# Altium schematic sheet 3_Port_IO板.schdoc.schdoc
size 431 x 309 mm; Symbol: Sheet-Symbol_A3; Device: Sheet-Symbol_A3; Company: 嘉立创EDA; Version: V1.0; Page Size: A3; @Project Name: 0117_230627_uMSX 4.0; @Page Count: 4; @Update Date: 2023-07-03; @Schematic Name: uMSX 4.0; @Page No: 3; @Page Name: Port/IO板
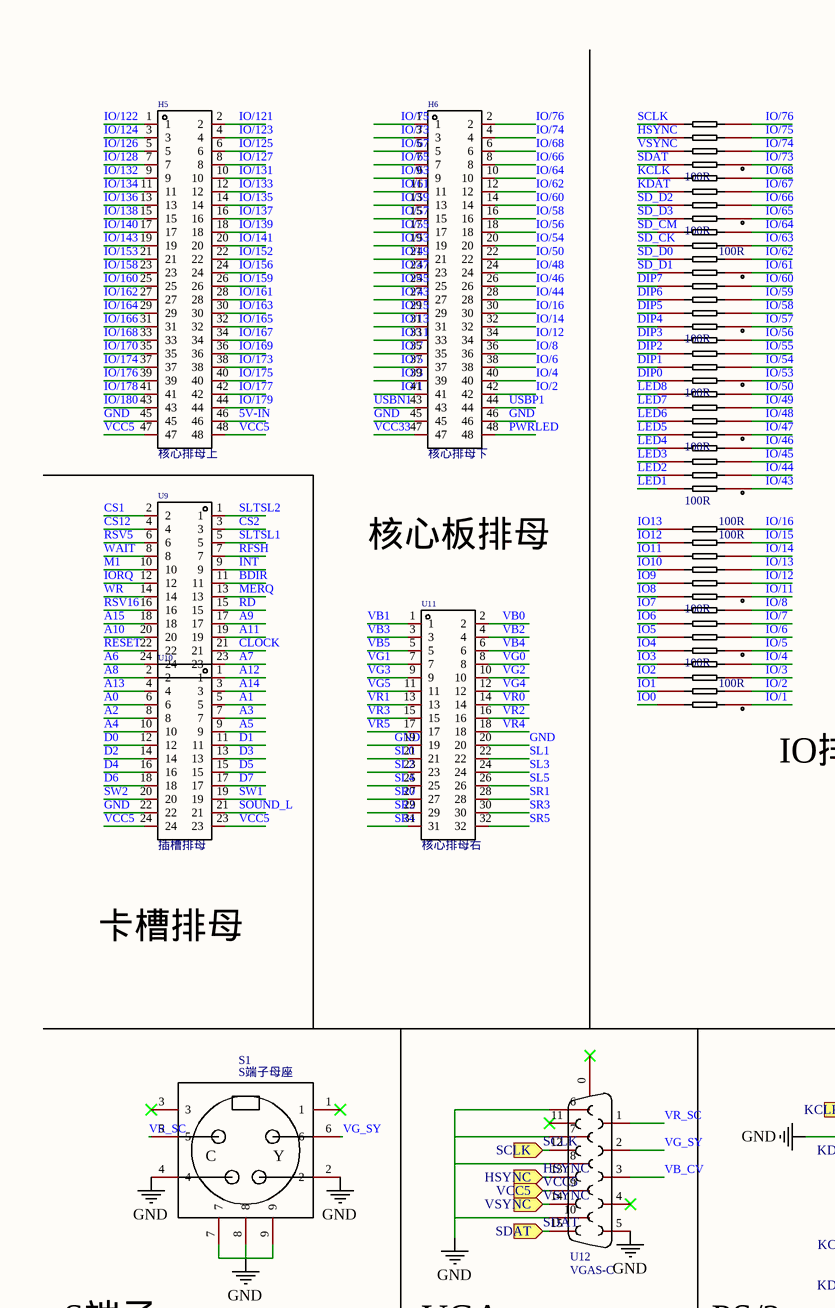
[diagram p0: 3_Port_IO板.schdoc.schdoc, top left]
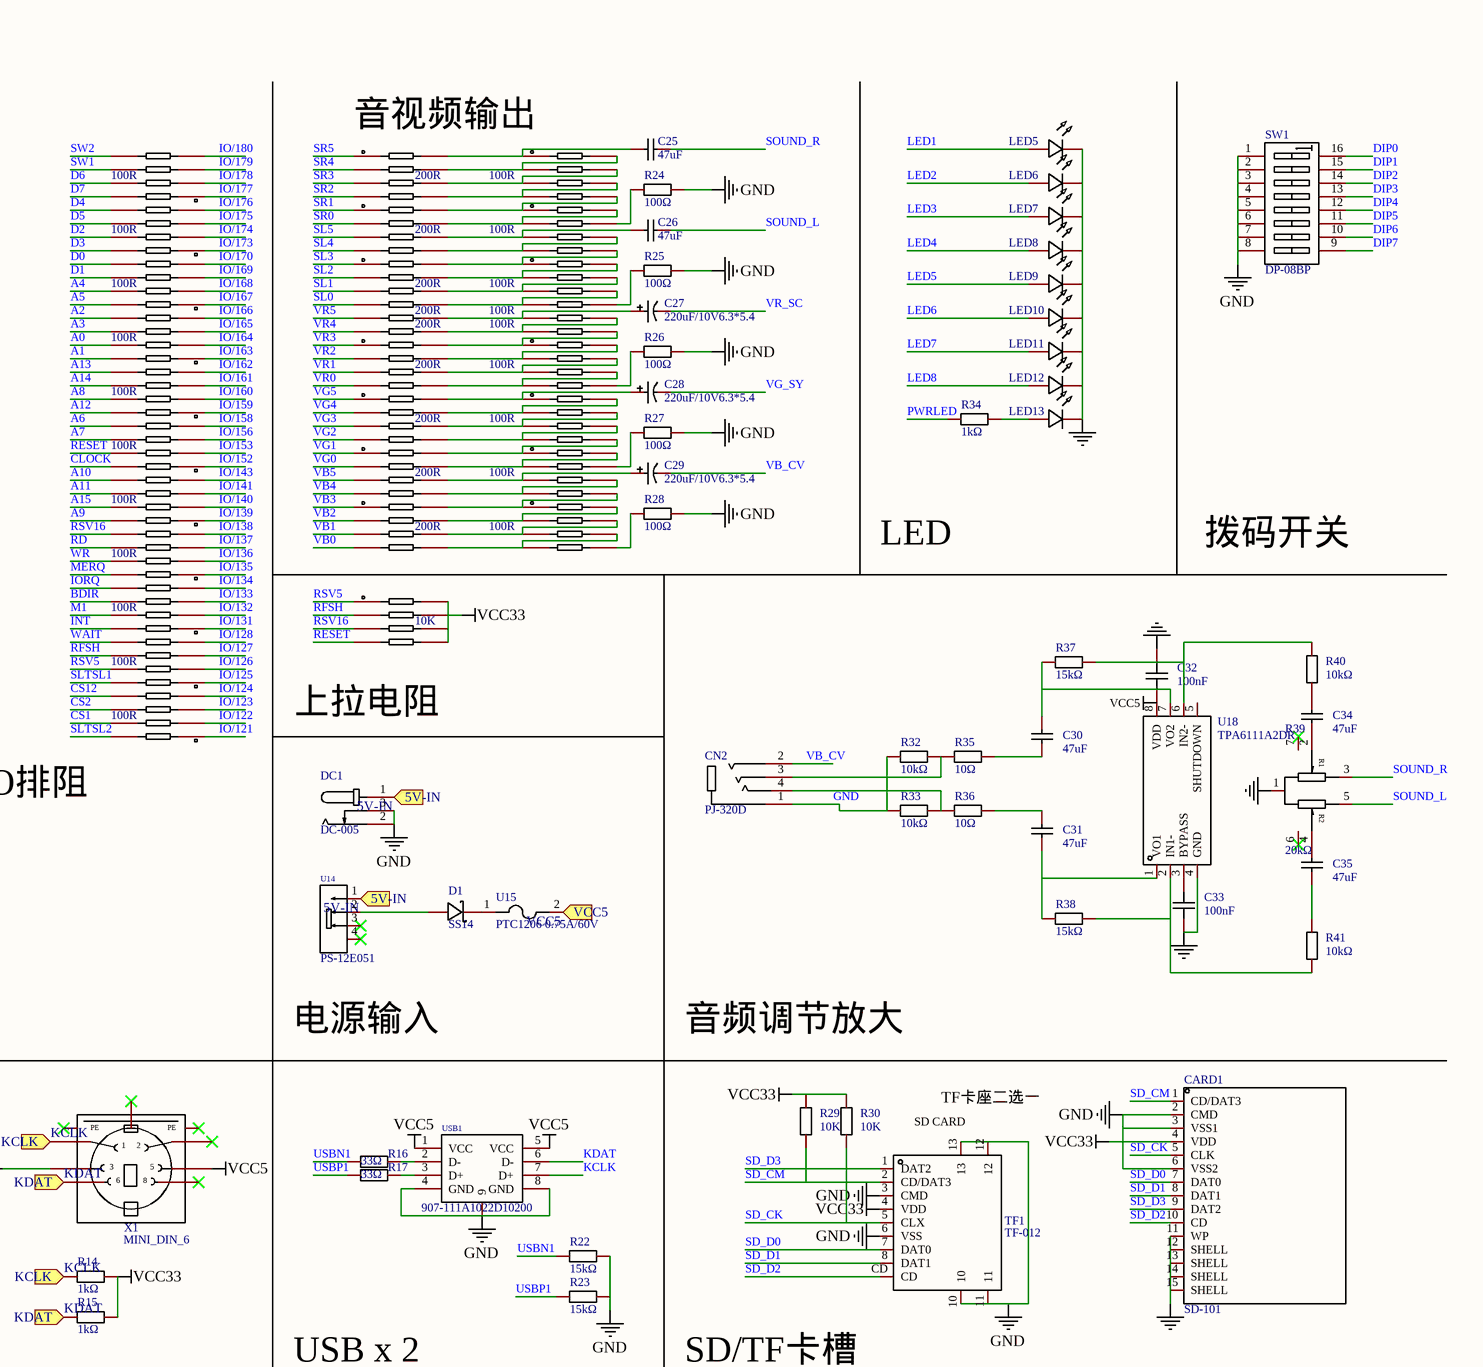
[diagram p1: 3_Port_IO板.schdoc.schdoc, top right]
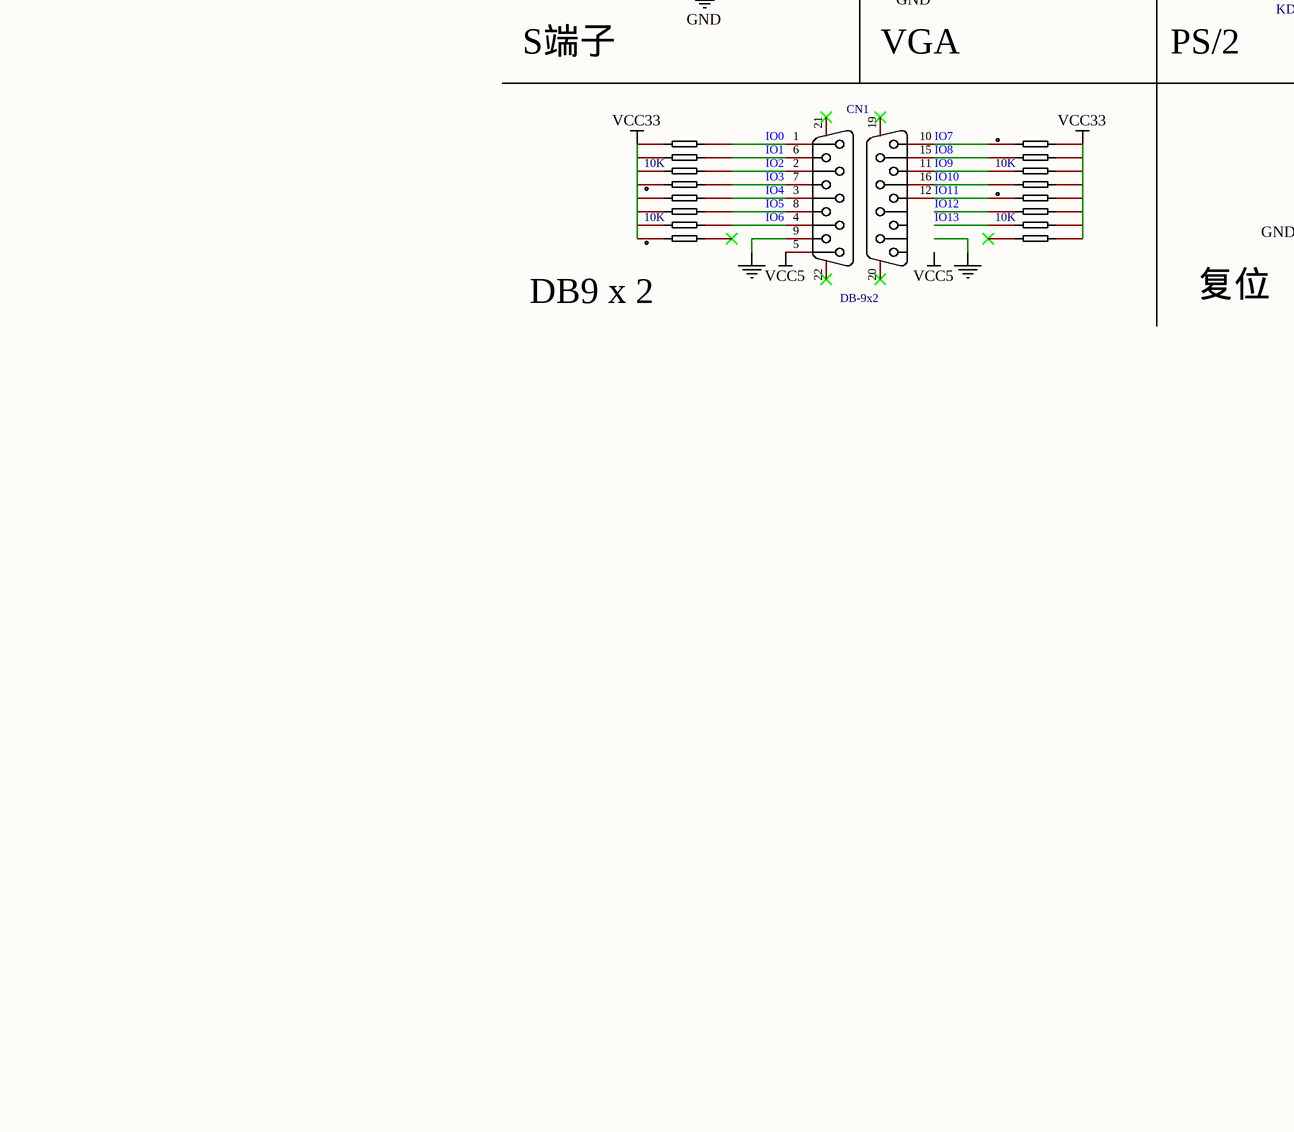
[diagram p2: 3_Port_IO板.schdoc.schdoc, bottom left]
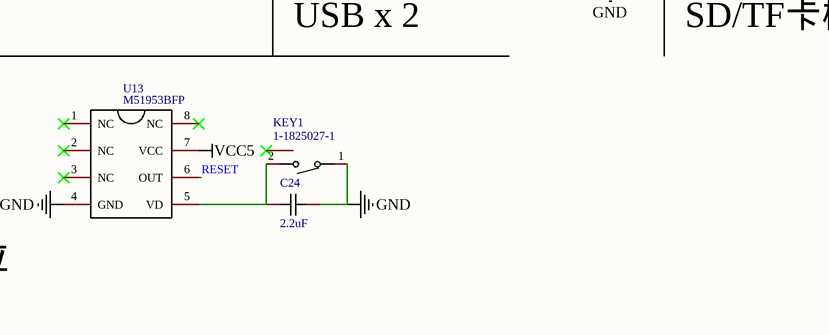
[diagram p3: 3_Port_IO板.schdoc.schdoc, bottom right]

## Parts
C24  2.2uF  [C0603]
C25  47uF  [C0805]
C26  47uF  [C0805]
C27  220uF/10V6.3*5.4  [CAP-SMD_BD6.3-L6.6-W6.6-LS7.2-FD]
C28  220uF/10V6.3*5.4  [CAP-SMD_BD6.3-L6.6-W6.6-LS7.2-FD]
C29  220uF/10V6.3*5.4  [CAP-SMD_BD6.3-L6.6-W6.6-LS7.2-FD]
C30  47uF  [C0805]
C31  47uF  [C0805]
C32  100nF  [C0603]
C33  100nF  [C0603]
C34  47uF  [C0805]
C35  47uF  [C0805]
CARD1  SD-101  [SD-SMD_SD-101]
CN1  DB-9x2  [DSUB-TH_HYC33-VGA18A-158]
CN2  PJ-320D  [AUDIO-SMD_PJ-320D]
D1  SS14  [SMA_L4.2-W2.6-LS5.3-RD]
DC1  DC-005  [DC-IN-TH_DC-005-A]
H5  核心排母上  [HDR-TH_48P-P2.54-V-F-R2-C24-S2.54]
H6  核心排母下  [HDR-TH_48P-P2.54-V-F-R2-C24-S2.54]
KEY1  1-1825027-1  [KEY-TH_1-1825027-1]
LED5  LED_0603-R  [LED_0603]  (value not drawn)
LED6  LED_0603-R  [LED_0603]  (value not drawn)
LED7  LED_0603-R  [LED_0603]  (value not drawn)
LED8  LED_0603-R  [LED_0603]  (value not drawn)
LED9  LED_0603-R  [LED_0603]  (value not drawn)
LED10  LED_0603-R  [LED_0603]  (value not drawn)
LED11  LED_0603-R  [LED_0603]  (value not drawn)
LED12  LED_0603-R  [LED_0603]  (value not drawn)
LED13  LED_0603-R  [LED_0603]  (value not drawn)
R1  100R  [R0603]
R2  100R  [R0603]
R14  1kΩ  [R0603]
R15  1kΩ  [R0603]
R16  33Ω  [R0603]
R17  33Ω  [R0603]
R18  200R  [R0603]
R19  200R  [R0603]
R20  100R  [R0603]
R21  100R  [R0603]
R22  15kΩ  [R0603]
R23  15kΩ  [R0603]
R24  100Ω  [R0603]
R25  100Ω  [R0603]
R26  100Ω  [R0603]
R27  100Ω  [R0603]
R28  100Ω  [R0603]
R29  10K  [R0603]
R30  10K  [R0603]
R32  10kΩ  [R0603]
R33  10kΩ  [R0603]
R34  1kΩ  [R0603]
R35  10Ω  [R0603]
R36  10Ω  [R0603]
R37  15kΩ  [R0603]
R38  15kΩ  [R0603]
R39  20kΩ  [RES-TH_RK10J12E002L]
R40  10kΩ  [R0603]
R41  10kΩ  [R0603]
RN1  10K  [RES-ARRAY-SMD_0603-8P-L3.2-W1.6-BL]
RN3  10K  [RES-ARRAY-SMD_0603-8P-L3.2-W1.6-BL]
RN4  10K  [RES-ARRAY-SMD_0603-8P-L3.2-W1.6-BL]
RN5  10K  [RES-ARRAY-SMD_0603-8P-L3.2-W1.6-BL]
RN6  100R  [RES-ARRAY-SMD_0603-8P-L3.2-W1.6-BL]
RN7  100R  [RES-ARRAY-SMD_0603-8P-L3.2-W1.6-BL]
RN8  100R  [RES-ARRAY-SMD_0603-8P-L3.2-W1.6-BL]
RN9  100R  [RES-ARRAY-SMD_0603-8P-L3.2-W1.6-BL]
RN10  100R  [RES-ARRAY-SMD_0603-8P-L3.2-W1.6-BL]
RN11  100R  [RES-ARRAY-SMD_0603-8P-L3.2-W1.6-BL]
RN12  100R  [RES-ARRAY-SMD_0603-8P-L3.2-W1.6-BL]
RN13  100R  [RES-ARRAY-SMD_0603-8P-L3.2-W1.6-BL]
RN14  100R  [RES-ARRAY-SMD_0603-8P-L3.2-W1.6-BL]
RN15  100R  [RES-ARRAY-SMD_0603-8P-L3.2-W1.6-BL]
RN16  100R  [RES-ARRAY-SMD_0603-8P-L3.2-W1.6-BL]
RN17  100R  [RES-ARRAY-SMD_0603-8P-L3.2-W1.6-BL]
RN18  100R  [RES-ARRAY-SMD_0603-8P-L3.2-W1.6-BL]
RN19  100R  [RES-ARRAY-SMD_0603-8P-L3.2-W1.6-BL]
RN20  100R  [RES-ARRAY-SMD_0603-8P-L3.2-W1.6-BL]
RN21  100R  [RES-ARRAY-SMD_0603-8P-L3.2-W1.6-BL]
RN22  100R  [RES-ARRAY-SMD_0603-8P-L3.2-W1.6-BL]
RN23  100R  [RES-ARRAY-SMD_0603-8P-L3.2-W1.6-BL]
RN24  100R  [RES-ARRAY-SMD_0603-8P-L3.2-W1.6-BL]
RN25  100R  [RES-ARRAY-SMD_0603-8P-L3.2-W1.6-BL]
RN26  100R  [RES-ARRAY-SMD_0603-8P-L3.2-W1.6-BL]
RN27  200R  [RES-ARRAY-SMD_0603-8P-L3.2-W1.6-BL]
RN28  200R  [RES-ARRAY-SMD_0603-8P-L3.2-W1.6-BL]
RN29  200R  [RES-ARRAY-SMD_0603-8P-L3.2-W1.6-BL]
RN30  200R  [RES-ARRAY-SMD_0603-8P-L3.2-W1.6-BL]
RN31  200R  [RES-ARRAY-SMD_0603-8P-L3.2-W1.6-BL]
RN32  200R  [RES-ARRAY-SMD_0603-8P-L3.2-W1.6-BL]
RN33  200R  [RES-ARRAY-SMD_0603-8P-L3.2-W1.6-BL]
RN34  10K  [RES-ARRAY-SMD_0603-8P-L3.2-W1.6-BL]
RN35  100R  [RES-ARRAY-SMD_0603-8P-L3.2-W1.6-BL]
RN36  100R  [RES-ARRAY-SMD_0603-8P-L3.2-W1.6-BL]
RN37  100R  [RES-ARRAY-SMD_0603-8P-L3.2-W1.6-BL]
RN38  100R  [RES-ARRAY-SMD_0603-8P-L3.2-W1.6-BL]
RN39  100R  [RES-ARRAY-SMD_0603-8P-L3.2-W1.6-BL]
RN40  100R  [RES-ARRAY-SMD_0603-8P-L3.2-W1.6-BL]
RN41  100R  [RES-ARRAY-SMD_0603-8P-L3.2-W1.6-BL]
S1  S端子母座  [S端子母座]
SW1  DP-08BP  [SW-TH_DP-08XP]
TF1  TF-012  [TF-SMD_TF-012]
U9  PM254-2-12-W-8.5  [HDR-TH_24P-P2.54-H-F-R2-C12-W8.5]  (value not drawn)
U10  插槽排母  [HDR-TH_24P-P2.54-H-F-R2-C12-W8.5]
U11  核心排母右  [HDR-TH_32P-P2.54-V-F-R2-C16-S2.54]
U12  VGAS-C  [DB15-TH_FDB1519-F0DB300U1KA]
U13  M51953BFP  [SOP-8_L4.9-W3.8-P1.27-LS6.0-BL]
U14  PS-12E051  [SW-TH_PS-12E051XX]
U15  PTC1206 0.75A/60V  [F1206]
U18  TPA6111A2DR  [SOIC-8_L5.0-W4.0-P1.27-LS6.0-BL]
USB1  907-111A1022D10200  [USB-A-TH_USB-M-51]
X1  MINI_DIN_6  [M_DIN6]

## Ports
5V-IN (in), HSYNC (in), KCLK (in), KDAT (in), SCLK (in), SDAT (in), VCC5 (in), VSYNC (in)

## Nets
GND: C24.2 CARD1.2(CMD) CARD1.3(VSS1) CARD1.6(VSS2) CN2.1 DC1.2 DC1.3 H5.45 H6.45 H6.46 KEY1.1 R22.1 R23.1 R24.2 R25.2 R26.2 R27.2 R28.2 R32.2 R33.2 S1.2 S1.4 S1.7 S1.8 S1.9 SW1.1(A1) SW1.2(A2) SW1.3(A3) SW1.4(A4) SW1.5(A5) SW1.6(A6) SW1.7(A7) SW1.8(A8) TF1.3(CMD) TF1.6(VSS) TF1.10 TF1.11 TF1.12 TF1.13 U10.22 U11.19 U11.20 U12.5 U12.6 U12.7 U12.8 U12.10 U13.4(GND) USB1.4(GND) USB1.8(GND) USB1.9 X1.3
NetC32_1: C32.1 C33.2 CARD1.11(WP) CARD1.12(SHELL) CARD1.13(SHELL) CARD1.14(SHELL) CARD1.15(SHELL) CN1.9 LED5.1(C) LED6.1(C) LED7.1(C) LED8.1(C) LED9.1(C) LED10.1(C) LED11.1(C) LED12.1(C) LED13.1(C) R39.1 U18.4(GND)
VCC5: C32.2 CN1.5 H5.47 H5.48 U10.23 U10.24 U12.9 U13.7(VCC) U15.2 U18.8(VDD) USB1.1(VCC) USB1.5(VCC) X1.5 ; port VCC5
VCC33: CARD1.4(VDD) H6.47 R14.2 R15.2 R29.2 R30.2 RN1.1 RN1.2 RN1.3 RN1.4 RN3.1 RN3.2 RN3.3 RN3.4 RN4.5 RN4.6 RN4.7 RN4.8 RN5.5 RN5.6 RN5.7 RN5.8 RN34.5 RN34.6 RN34.7 RN34.8 TF1.4(VDD)
5V-IN: DC1.1 H5.46 U14.1 ; port 5V-IN
A0: RN19.7 U10.6
A1: RN19.8 U10.5
A2: RN19.5 U10.8
A3: RN19.6 U10.7
A4: RN18.7 U10.10
A5: RN18.8 U10.9
A6: RN21.5 U9.24
A7: RN21.6 U9.23
A8: RN20.7 U10.2
A9: RN22.8 U9.17
A10: RN22.5 U9.20
A11: RN22.6 U9.19
A12: RN20.8 U10.1
A13: RN20.5 U10.4
A14: RN20.6 U10.3
A15: RN22.7 U9.18
BDIR: RN24.6 U9.11
CLOCK: RN21.8 U9.21
CS1: RN26.7 U9.2
CS2: RN26.6 U9.3
CS12: RN26.5 U9.4
D0: RN18.5 U10.12
D1: RN18.6 U10.11
D2: RN17.7 U10.14
D3: RN17.8 U10.13
D4: RN17.5 U10.16
D5: RN17.6 U10.15
D6: RN16.7 U10.18
D7: RN16.8 U10.17
DIP0: RN10.8 SW1.16(B1)
DIP1: RN10.7 SW1.15(B2)
DIP2: RN10.6 SW1.14(B3)
DIP3: RN10.5 SW1.13(B4)
DIP4: RN9.8 SW1.12(B5)
DIP5: RN9.7 SW1.11(B6)
DIP6: RN9.6 SW1.10(B7)
DIP7: RN9.5 SW1.9(B8)
HSYNC: RN6.6 U12.13 ; port HSYNC
INT: RN24.8 U9.9
IO0: CN1.1 RN1.5 RN15.8
IO1: CN1.6 RN1.6 RN15.7
IO2: CN1.2 RN1.7 RN15.6
IO3: CN1.7 RN1.8 RN15.5
IO4: CN1.3 RN3.5 RN14.8
IO5: CN1.8 RN3.6 RN14.7
IO6: CN1.4 RN3.7 RN14.6
IO7: CN1.10 RN4.1 RN14.5
IO8: CN1.15 RN4.2 RN13.8
IO9: CN1.11 RN4.3 RN13.7
IO10: CN1.16 RN4.4 RN13.6
IO11: CN1.12 RN5.1 RN13.5
IO12: R2.1 RN5.2
IO13: R1.1 RN5.3
IO/1: H6.41 RN15.1
IO/2: H6.42 RN15.2
IO/3: H6.39 RN15.3
IO/4: H6.40 RN15.4
IO/5: H6.37 RN14.1
IO/6: H6.38 RN14.2
IO/7: H6.35 RN14.3
IO/8: H6.36 RN14.4
IO/11: H6.33 RN13.1
IO/12: H6.34 RN13.2
IO/13: H6.31 RN13.3
IO/14: H6.32 RN13.4
IO/15: H6.29 R2.2
IO/16: H6.30 R1.2
IO/43: H6.27 RN12.1
IO/44: H6.28 RN12.2
IO/45: H6.25 RN12.3
IO/46: H6.26 RN12.4
IO/47: H6.23 RN11.1
IO/48: H6.24 RN11.2
IO/49: H6.21 RN11.3
IO/50: H6.22 RN11.4
IO/53: H6.19 RN10.1
IO/54: H6.20 RN10.2
IO/55: H6.17 RN10.3
IO/56: H6.18 RN10.4
IO/57: H6.15 RN9.1
IO/58: H6.16 RN9.2
IO/59: H6.13 RN9.3
IO/60: H6.14 RN9.4
IO/61: H6.11 RN8.1
IO/62: H6.12 RN8.2
IO/63: H6.9 RN8.3
IO/64: H6.10 RN8.4
IO/65: H6.7 RN7.1
IO/66: H6.8 RN7.2
IO/67: H6.5 RN7.3
IO/68: H6.6 RN7.4
IO/73: H6.3 RN6.1
IO/74: H6.4 RN6.2
IO/75: H6.1 RN6.3
IO/76: H6.2 RN6.4
IO/121: H5.2 RN26.1
IO/122: H5.1 RN26.2
IO/123: H5.4 RN26.3
IO/124: H5.3 RN26.4
IO/125: H5.6 RN25.1
IO/126: H5.5 RN25.2
IO/127: H5.8 RN25.3
IO/128: H5.7 RN25.4
IO/131: H5.10 RN24.1
IO/132: H5.9 RN24.2
IO/133: H5.12 RN24.3
IO/134: H5.11 RN24.4
IO/135: H5.14 RN23.1
IO/136: H5.13 RN23.2
IO/137: H5.16 RN23.3
IO/138: H5.15 RN23.4
IO/139: H5.18 RN22.1
IO/140: H5.17 RN22.2
IO/141: H5.20 RN22.3
IO/143: H5.19 RN22.4
IO/152: H5.22 RN21.1
IO/153: H5.21 RN21.2
IO/156: H5.24 RN21.3
IO/158: H5.23 RN21.4
IO/159: H5.26 RN20.1
IO/160: H5.25 RN20.2
IO/161: H5.28 RN20.3
IO/162: H5.27 RN20.4
IO/163: H5.30 RN19.1
IO/164: H5.29 RN19.2
IO/165: H5.32 RN19.3
IO/166: H5.31 RN19.4
IO/167: H5.34 RN18.1
IO/168: H5.33 RN18.2
IO/169: H5.36 RN18.3
IO/170: H5.35 RN18.4
IO/173: H5.38 RN17.1
IO/174: H5.37 RN17.2
IO/175: H5.40 RN17.3
IO/176: H5.39 RN17.4
IO/177: H5.42 RN16.1
IO/178: H5.41 RN16.2
IO/179: H5.44 RN16.3
IO/180: H5.43 RN16.4
IORQ: RN24.5 U9.12
KCLK: R14.1 RN7.5 USB1.7(D+) X1.1 ; port KCLK
KDAT: R15.1 RN7.6 USB1.6(D-) X1.6 ; port KDAT
LED1: LED5.2(A) RN12.8
LED2: LED6.2(A) RN12.7
LED3: LED7.2(A) RN12.6
LED4: LED8.2(A) RN12.5
LED5: LED9.2(A) RN11.8
LED6: LED10.2(A) RN11.7
LED7: LED11.2(A) RN11.6
LED8: LED12.2(A) RN11.5
M1: RN24.7 U9.10
MERQ: RN23.8 U9.13
PWRLED: H6.48 R34.1
RD: RN23.6 U9.15
RESET: RN21.7 RN34.4 U9.22 U13.6(OUT)
RFSH: RN25.6 RN34.2 U9.7
RSV5: RN25.7 RN34.1 U9.6
RSV16: RN23.5 RN34.3 U9.16
SCLK: RN6.5 U12.12 ; port SCLK
SD_CK: CARD1.5(CLK) R30.1 RN8.6 TF1.5(CLX)
SD_CM: CARD1.1(CD/DAT3) R29.1 RN8.5 TF1.2(CD/DAT3)
SD_D0: CARD1.7(DAT0) RN8.7 TF1.7(DAT0)
SD_D1: CARD1.8(DAT1) RN8.8 TF1.8(DAT1)
SD_D2: CARD1.10(CD) RN7.7 TF1.CD
SD_D3: CARD1.9(DAT2) RN7.8 TF1.1(DAT2)
SDAT: RN6.8 U12.15 ; port SDAT
SL0: RN29.4 U11.21
SL1: RN29.3 U11.22
SL2: RN29.2 U11.23
SL3: RN29.1 U11.24
SL4: RN28.4 U11.25
SL5: RN28.3 U11.26
SLTSL1: RN25.8 U9.5
SLTSL2: RN26.8 U9.1
SOUND_L: C26.1 R39.5 U10.21
SOUND_R: C25.1 R39.3
SR0: RN28.2 U11.27
SR1: RN28.1 U11.28
SR2: RN27.4 U11.29
SR3: RN27.3 U11.30
SR4: RN27.2 U11.31
SR5: RN27.1 U11.32
SW1: RN16.6 U10.19
SW2: RN16.5 U10.20
USBN1: H6.43 R16.1 R22.2
USBP1: H6.44 R17.1 R23.2
VB0: RN33.4 U11.2
VB1: RN33.3 U11.1
VB2: RN33.2 U11.4
VB3: RN33.1 U11.3
VB4: RN32.4 U11.6
VB5: RN32.3 U11.5
VB_CV: C29.2 CN2.2 U12.3
VG0: RN32.2 U11.8
VG1: RN32.1 U11.7
VG2: RN31.4 U11.10
VG3: RN31.3 U11.9
VG4: RN31.2 U11.12
VG5: RN31.1 U11.11
VG_SY: C28.2 S1.6 U12.2
VR0: RN30.4 U11.14
VR1: RN30.3 U11.13
VR2: RN30.2 U11.16
VR3: RN30.1 U11.15
VR4: R19.1 U11.18
VR5: R18.1 U11.17
VR_SC: C27.2 S1.5 U12.1
VSYNC: RN6.7 U12.14 ; port VSYNC
WAIT: RN25.5 U9.8
WR: RN23.7 U9.14
NetC24_1: C24.1 KEY1.2 U13.5(VD)
NetC25_2: C25.2 RN27.8 RN35.1
NetC26_2: C26.2 RN28.6 RN36.3
NetC27_1: C27.1 R18.2 R20.1
NetC28_1: C28.1 RN31.8 RN39.1
NetC29_1: C29.1 RN32.6 RN40.3
NetC30_1: C30.1 R37.2 U18.7(VO2)
NetC30_2: C30.2 R35.1
NetC31_1: C31.1 R36.1
NetC31_2: C31.2 R38.2 U18.1(VO1)
NetC33_1: C33.1 U18.3(BYPASS)
NetC34_1: C34.1 R40.2
NetC34_2: C34.2 R39.2
NetC35_1: C35.1 R39.4
NetC35_2: C35.2 R41.1
NetCN2_3: CN2.3 R32.1 R35.2
NetCN2_4: CN2.4 R33.1 R36.2
NetD1_1: D1.1(K) U15.1
NetD1_2: D1.2(A) U14.2
NetLED13_2: LED13.2(A) R34.2
NetR16_2: R16.2 USB1.2(D-)
NetR17_2: R17.2 USB1.3(D+)
NetR19_2: R19.2 R20.2 R21.1
NetR21_2: R21.2 RN30.8 RN38.1
NetR24_1: R24.1 RN36.7
NetR25_1: R25.1 RN37.5
NetR26_1: R26.1 RN38.5
NetR27_1: R27.1 RN40.7
NetR28_1: R28.1 RN41.5
NetR37_1: R37.1 R40.1 U18.6(IN2-)
NetR38_1: R38.1 R41.2 U18.2(IN1-)
NetRN27_5: RN27.5 RN35.4 RN35.6
NetRN27_6: RN27.6 RN35.3 RN35.7
NetRN27_7: RN27.7 RN35.2 RN35.8
NetRN28_5: RN28.5 RN36.4 RN36.6
NetRN28_7: RN28.7 RN36.2 RN36.8
NetRN28_8: RN28.8 RN35.5 RN36.1
NetRN29_5: RN29.5 RN37.4 RN37.6
NetRN29_6: RN29.6 RN37.3 RN37.7
NetRN29_7: RN29.7 RN37.2 RN37.8
NetRN29_8: RN29.8 RN36.5 RN37.1
NetRN30_5: RN30.5 RN38.4 RN38.6
NetRN30_6: RN30.6 RN38.3 RN38.7
NetRN30_7: RN30.7 RN38.2 RN38.8
NetRN31_5: RN31.5 RN39.4 RN39.6
NetRN31_6: RN31.6 RN39.3 RN39.7
NetRN31_7: RN31.7 RN39.2 RN39.8
NetRN32_5: RN32.5 RN40.4 RN40.6
NetRN32_7: RN32.7 RN40.2 RN40.8
NetRN32_8: RN32.8 RN39.5 RN40.1
NetRN33_5: RN33.5 RN41.4 RN41.6
NetRN33_6: RN33.6 RN41.3 RN41.7
NetRN33_7: RN33.7 RN41.2 RN41.8
NetRN33_8: RN33.8 RN40.5 RN41.1

Not connected (* = marked no-connect by the designer): CN1 13 14 17 18 19* 20* 21* 22*; KEY1 0*; R39 6(EH)* 7(EH)*; RN3 8*; RN5 4*; S1 1* 3*; U12 0* 4* 11*; U13 1(NC)* 2(NC)* 3(NC)* 8(NC)*; U14 3* 4*; U18 5(SHUTDOWN); X1 2* 8* SH1(PE1)* SH2(PE2)* SH3(PE3)*

## Notes on the sheet
- (near RN27) 音视频输出
- LED
- 拨码开关
- 核心板排母
- (near RN34) 上拉电阻
- IO排阻
- 卡槽排母
- 电源输入
- 音频调节放大
- (near TF1) TF卡座二选一
- (near TF1) SD CARD
- S端子
- VGA
- PS/2
- USB x 2
- SD/TF卡槽
- (near RN3) DB9 x 2
- 复位
- 1
- 2
- 3
- 4
- 5
- 6
- A
- B
- C
- Schematic
- uMSX 4.0
- Create Date
- Update Date
- 2023-07-03
- D
- Reviewed
- Drawed
- Page
- Port/IO板
- Part Number
- 0117_230627_uMSX 4.0
- VER
- SIZE
- PAGE
- OF
- V1.0
- A3
- 嘉立创EDA
- (in symbol MINI_DIN_6) PE
- (in symbol RK10J12E0024) R1; R2
- (in symbol S端子母座) C; Y

## Library data of the parts
C24 = UMK107BBJ225KA-T: Manufacturer: TAIYO YUDEN(太诱); Add into BOM: yes; Tolerance: ±10%; Voltage Rated: 50V; Temperature Coefficient: X5R; Description: 容值:2.2uF;精度:±10%;额定电压:50V;材质(温度系数):X5R;; Name: 2.2uF; Symbol: UMK107BBJ225KA-T; Device: UMK107BBJ225KA-T; LCSC Part Name: 2.2uF ±10% 50V UMK107BBJ225KA-T; Supplier Part: C268016; Manufacturer Part: UMK107BBJ225KA-T; Supplier Footprint: 0603; JLCPCB Part Class: Extended Part; Datasheet: https://atta.szlcsc.com/upload/public/pdf/source/20210525/C2802164_C0429B055888A674C3F00BA74B841C5B.pdf; Supplier: LCSC; Convert to PCB: yes; Value: 2.2uF
C25 C26 C30 C31 C34 C35 = CL21A476MQYNNNE: Manufacturer: SAMSUNG(三星); Add into BOM: yes; Tolerance: ±20%; Voltage Rated: 6.3V; Temperature Coefficient: X5R; Description: 容值:47uF;精度:±20%;额定电压:6.3V;材质(温度系数):X5R;; Name: 47uF; Symbol: CL21A476MQYNNNE; Device: CL21A476MQYNNNE; LCSC Part Name: 47uF ±20% 6.3V; Supplier Part: C16780; Manufacturer Part: CL21A476MQYNNNE; Supplier Footprint: 0805; JLCPCB Part Class: Basic Part; Datasheet: https://atta.szlcsc.com/upload/public/pdf/source/20160103/1457707690276.pdf; Supplier: LCSC; Convert to PCB: yes; Value: 47uF
C27-C29 = 固态电容220uF/10V6.3*5.4: Add into BOM: yes; Name: 220uF/10V6.3*5.4; Symbol: 固态电容220UF/10V6.3*5.4; Device: 固态电容220uF/10V6.3*5.4; LCSC Part Name: 固态电容220uF/10V6.3*5.4; Supplier Part: C9900001736; Manufacturer Part: 220uF/10V6.3*5.4; Supplier Footprint: CAP-SMD_6.3X5.4; JLCPCB Part Class: Extended Part; Datasheet: https://atta.szlcsc.comnull; Supplier: LCSC; Convert to PCB: yes
C32 C33 = CC0603KRX7R9BB104: Manufacturer: YAGEO(国巨); Add into BOM: yes; Tolerance: ±10%; Voltage Rated: 50V; Temperature Coefficient: X7R; Description: 容值:100nF;精度:±10%;额定电压:50V;材质(温度系数):X7R;; Name: 100nF; Symbol: CC0603KRX7R9BB104; Device: CC0603KRX7R9BB104; LCSC Part Name: 100nF ±10% 50V; Supplier Part: C14663; Manufacturer Part: CC0603KRX7R9BB104; Supplier Footprint: 0603; JLCPCB Part Class: Basic Part; Datasheet: https://atta.szlcsc.com/upload/public/pdf/source/20180910/C282072_33301C7F631E79921B82A8DAC6BCC5B3.pdf; Supplier: LCSC; Convert to PCB: yes; Value: 100nF
CARD1 = SD-101: Manufacturer: XUNPU(讯普); Add into BOM: yes; Card Connection Mode: 拔插式; Card Type: 标准SD卡; Connector Type: 卡座; Maximum Body Height: 2.8mm; Welding Temperature (Max): 260℃; Description: 卡连接方式:拔插式;卡类型:标准SD卡;连接器类型:卡座;本体最大高度:2.8mm;触头材质:C5191;触头镀层:银;工作温度范围:-25℃~+85℃;焊接温度(最大值):260℃;; Name: SD-101; Symbol: SD-101; Device: SD-101; LCSC Part Name: 拔插式 标准SD卡 卡座 短体; Supplier Part: C266601; Manufacturer Part: SD-101; Supplier Footprint: SMD; JLCPCB Part Class: Extended Part; Datasheet: https://atta.szlcsc.com/upload/public/pdf/source/20210906/BABA0B62C0AC456F59CF79A048A6081D.pdf; Supplier: LCSC; Convert to PCB: yes; Contact Material: C5191; Contact Plating: 银; Operating Temperature Range: -25℃~+85℃
CN1 = HYC33-VGA18A-158: Manufacturer: 华宇创; Add into BOM: yes; Connector Type: D-Sub; Gender: 公; Current Rating (Max): 3A; Description: 连接器类型:D-Sub;公母:公;总PIN位数:-;排数:-;安装方式:弯插;额定电流:3A;工作温度范围:-55℃~+105℃;; Name: DB-9x2; Symbol: HYC33-VGA18A-158; Device: HYC33-VGA18A-158; LCSC Part Name: DR9公对DR9公 间距15.88 锁螺丝(二合一); Supplier Part: C711359; Manufacturer Part: DB-9x2; Supplier Footprint: 插件; JLCPCB Part Class: Extended Part; Datasheet: https://atta.szlcsc.com/upload/public/pdf/source/20200812/C711359_5ACE3EF6ECEA2232C79EC9948A0A66FB.pdf; Supplier: LCSC; Convert to PCB: yes; Number of Pins: -; Number of Rows: -; Mounting Style: 弯插; Operating Temperature Range: -55℃~+105℃
CN2 = PJ-320D_C431535: Manufacturer: SHOU HAN(首韩); Add into BOM: yes; Connector Type: 3.5mm耳机座; Current Rating (Max): 300mA; Voltage Rating (Max): 50V; Description: 连接器类型:3.5mm耳机座;额定电流:300mA;额定电压:50V;工作温度范围:-16℃~+65℃;; Name: PJ-320D; Symbol: PJ-320D; Device: PJ-320D_C431535; LCSC Part Name: 3.5mm耳机座; Supplier Part: C431535; Manufacturer Part: PJ-320D; Supplier Footprint: SMD; JLCPCB Part Class: Extended Part; Datasheet: https://atta.szlcsc.com/upload/public/pdf/source/20190925/C431535_8B274506621F6117FB020BF07A197848.pdf; Supplier: LCSC; Convert to PCB: yes; Operating Temperature Range: -16℃~+65℃
D1 = SS14_C2480: Manufacturer: MDD; Add into BOM: yes; Diode Configuration: 独立式; Reverse Voltage (Vr): 40V; Average Rectified Current (Io): 1A; Forward Voltage (Vf@If): 550mV@1A; Reverse Leakage Current (Ir): 500uA@40V; Description: 二极管配置:独立式;直流反向耐压(Vr):40V;平均整流电流(Io):1A;正向压降(Vf):550mV@1A;反向电流(Ir):500uA@40V;; Name: SS14; Symbol: SS14; Device: SS14_C2480; LCSC Part Name: 40V 1A 550mV@1A 框架工艺; Supplier Part: C2480; Manufacturer Part: SS14; Supplier Footprint: SMA(DO-214AC); JLCPCB Part Class: Basic Part; Datasheet: https://atta.szlcsc.com/upload/public/pdf/source/20230314/CB2C302F91CEFB8A73D1DF7B261C7D58.pdf; Supplier: LCSC; Convert to PCB: yes
DC1 = DC-005: Add into BOM: yes; Name: DC-005; Symbol: DC-005; Device: DC-005; LCSC Part Name: DC-005; Supplier Part: C9900004933; Manufacturer Part: DC-005; Supplier Footprint: DC-IN-TH_3P-L14.2-W8.8-P4.80; JLCPCB Part Class: Extended Part; Supplier: LCSC; Convert to PCB: yes
H5 H6 = X5521FV-2x24-C70D30-1000: Manufacturer: XKB Connectivity(中国星坤); Add into BOM: yes; Number of Holes: 48; Pitch: 2.54mm; Holes Structure: 2x24P; Circular Hole / Square Hole: 圆孔; Current Rating (Max): 3A; Holes Direction: 顶部; Welding Temperature (Max): 260℃; Description: 排数:双排;总孔位数:48;间距:2.54mm;插孔结构:2x24P;行距:2.54mm;安装类型:直插;圆孔/方孔:圆孔;额定电流:3A;额定电压:-;插孔方向:顶部;塑高:7mm;触头材质:黄铜;触头镀层:金;工作温度范围:-40℃~+105℃;焊接温度(最大值):260℃;; Symbol: X5521FV-2X24-C70D30-1000; Device: X5521FV-2x24-C70D30-1000; Supplier: LCSC; Supplier Part: C2682211; JLCPCB Part Class: Extended Part; LCSC Part Name: 2.54mm 2x24P; Supplier Footprint: 直插,P=2.54mm; Convert to PCB: yes; Number of Rows: 双排; Row Spacing: 2.54mm; Mounting Type: 直插; Voltage Rating (Max): -; Insulation Height: 7mm; Contact Material: 黄铜; Contact Plating: 金; Operating Temperature Range: -40℃~+105℃
  H5: Name: 核心排母上; Manufacturer Part: 核心排母上
  H6: Name: 核心排母下; Manufacturer Part: 核心排母下
KEY1 = 1-1825027-1: Manufacturer: TE Connectivity(美国泰科); Add into BOM: yes; Contact Current: 50mA; Voltage Rating (DC): 24V; Circuit: 单刀单掷; Actuator Style: 圆形按钮; Switch Height: 5.74mm; Description: 触点电流:50mA;额定电压(DC):24V;电路结构:单刀单掷;安装方式:卧插;按钮形状:圆形按钮;带灯:-;开关高度:5.74mm;; Name: 1-1825027-1; Symbol: 1-1825027-1; Device: 1-1825027-1; LCSC Part Name: 1-1825027-1; Supplier Part: C266183; Manufacturer Part: 1-1825027-1; Supplier Footprint: 插件; JLCPCB Part Class: Extended Part; Datasheet: https://atta.szlcsc.com/upload/public/pdf/source/20181120/C266183_22980A79E51798DCE47D1A9101006296.pdf; Supplier: LCSC; Convert to PCB: yes; Mounting Style: 卧插; With Lamp: -
LED5-LED13 = LED_0603-R: Symbol: LED_R; Convert to PCB: yes; Device: LED_0603-R; Add into BOM: yes; Supplier Footprint: 0603
R1 R2 R18-R21 = Res_0603: Symbol: 电阻; Convert to PCB: yes; Device: Res_0603; Add into BOM: yes; Supplier Footprint: 0603
  R1 R2 R20 R21: Name: 100R; Value: 100R
  R18 R19: Name: 200R; Value: 200R
R14 R15 R34 = 0603WAF1001T5E: Manufacturer: UNI-ROYAL(厚声); Add into BOM: yes; Tolerance: ±1%; Power(Watts): 100mW; Temperature Coefficient: ±100ppm/℃; Overload Voltage (Max): 75V; Description: 电阻类型:厚膜电阻;阻值:1kΩ;精度:±1%;功率:100mW;; Name: 1kΩ; Symbol: 0603WAF1001T5E; Device: 0603WAF1001T5E; LCSC Part Name: 1kΩ ±1% 100mW; Supplier Part: C21190; Manufacturer Part: 0603WAF1001T5E; Supplier Footprint: 0603; JLCPCB Part Class: Basic Part; Datasheet: https://atta.szlcsc.com/upload/public/pdf/source/20200306/C422600_1E6D84923E4A46A82E41ADD87F860B5C.pdf; Supplier: LCSC; Convert to PCB: yes; Type: 厚膜电阻; Value: 1kΩ; Operating Temperature Range: -55℃~+155℃
R16 R17 = 0603WAF330JT5E: Manufacturer: UNI-ROYAL(厚声); Add into BOM: yes; Tolerance: ±1%; Power(Watts): 100mW; Temperature Coefficient: ±100ppm/℃; Overload Voltage (Max): 75V; Description: 电阻类型:厚膜电阻;阻值:33Ω;精度:±1%;功率:100mW;; Name: 33Ω; Symbol: 0603WAF330JT5E; Device: 0603WAF330JT5E; LCSC Part Name: 33Ω ±1% 100mW; Supplier Part: C23140; Manufacturer Part: 0603WAF330JT5E; Supplier Footprint: 0603; JLCPCB Part Class: Basic Part; Datasheet: https://atta.szlcsc.com/upload/public/pdf/source/20200306/C422600_1E6D84923E4A46A82E41ADD87F860B5C.pdf; Supplier: LCSC; Convert to PCB: yes; Type: 厚膜电阻; Value: 33Ω; Operating Temperature Range: -55℃~+155℃
R22 R23 R37 R38 = 0603WAF1502T5E: Manufacturer: UNI-ROYAL(厚声); Add into BOM: yes; Tolerance: ±1%; Power(Watts): 100mW; Temperature Coefficient: ±100ppm/℃; Overload Voltage (Max): 75V; Description: 电阻类型:厚膜电阻;阻值:15kΩ;精度:±1%;功率:100mW;; Name: 15kΩ; Symbol: 0603WAF1502T5E; Device: 0603WAF1502T5E; LCSC Part Name: 15kΩ ±1% 100mW; Supplier Part: C22809; Manufacturer Part: 0603WAF1502T5E; Supplier Footprint: 0603; JLCPCB Part Class: Basic Part; Datasheet: https://atta.szlcsc.com/upload/public/pdf/source/20200306/C422600_1E6D84923E4A46A82E41ADD87F860B5C.pdf; Supplier: LCSC; Convert to PCB: yes; Type: 厚膜电阻; Value: 15kΩ; Operating Temperature Range: -55℃~+155℃
R24-R28 = 0603WAF1000T5E: Manufacturer: UNI-ROYAL(厚声); Add into BOM: yes; Tolerance: ±1%; Power(Watts): 100mW; Temperature Coefficient: ±200ppm/℃; Overload Voltage (Max): 75V; Description: 电阻类型:厚膜电阻;阻值:100Ω;精度:±1%;功率:100mW;; Name: 100Ω; Symbol: 0603WAF1000T5E; Device: 0603WAF1000T5E; LCSC Part Name: 100Ω ±1% 100mW; Supplier Part: C22775; Manufacturer Part: 0603WAF1000T5E; Supplier Footprint: 0603; JLCPCB Part Class: Basic Part; Datasheet: https://atta.szlcsc.com/upload/public/pdf/source/20200306/C422600_1E6D84923E4A46A82E41ADD87F860B5C.pdf; Supplier: LCSC; Convert to PCB: yes; Type: 厚膜电阻; Value: 100Ω; Operating Temperature Range: -55℃~+155℃
R29 R30 R32 R33 R40 R41 = 0603WAF1002T5E: Manufacturer: UNI-ROYAL(厚声); Add into BOM: yes; Tolerance: ±1%; Power(Watts): 100mW; Temperature Coefficient: ±100ppm/℃; Overload Voltage (Max): 75V; Description: 电阻类型:厚膜电阻;阻值:10kΩ;精度:±1%;功率:100mW;; Symbol: 0603WAF1002T5E; Device: 0603WAF1002T5E; LCSC Part Name: 厚膜电阻 10kΩ ±1% 100mW; Supplier Part: C25804; Manufacturer Part: 0603WAF1002T5E; Supplier Footprint: 0603; JLCPCB Part Class: Basic Part; Datasheet: https://atta.szlcsc.com/upload/public/pdf/source/20200306/C422600_1E6D84923E4A46A82E41ADD87F860B5C.pdf; Supplier: LCSC; Convert to PCB: yes; Type: 厚膜电阻; Operating Temperature Range: -55℃~+155℃
  R29 R30: Name: 10K; Value: 10K
  R32 R33 R40 R41: Name: 10kΩ; Value: 10kΩ
R35 R36 = 0603WAF100JT5E: Manufacturer: UNI-ROYAL(厚声); Add into BOM: yes; Tolerance: ±1%; Power(Watts): 100mW; Temperature Coefficient: ±400ppm/℃; Overload Voltage (Max): 75V; Description: 电阻类型:厚膜电阻;阻值:10Ω;精度:±1%;功率:100mW;; Name: 10Ω; Symbol: 0603WAF100JT5E; Device: 0603WAF100JT5E; LCSC Part Name: 10Ω ±1% 100mW; Supplier Part: C22859; Manufacturer Part: 0603WAF100JT5E; Supplier Footprint: 0603; JLCPCB Part Class: Basic Part; Datasheet: https://atta.szlcsc.com/upload/public/pdf/source/20200306/C422600_1E6D84923E4A46A82E41ADD87F860B5C.pdf; Supplier: LCSC; Convert to PCB: yes; Type: 厚膜电阻; Value: 10Ω; Operating Temperature Range: -55℃~+155℃
R39 = RK10J12E0024: Manufacturer: ALPSALPINE(阿尔卑斯阿尔派); Add into BOM: yes; Tolerance: ±30%; Power(Watts): 30mW; Rated Voltage: 100V; Description: 阻值:20kΩ;精度:±30%;功率:30mW;; Name: 20kΩ; Symbol: RK10J12E0024; Device: RK10J12E0024; LCSC Part Name: 20kΩ ±30%; Supplier Part: C470675; Manufacturer Part: RK10J12E0024; Supplier Footprint: 插件; JLCPCB Part Class: Extended Part; Datasheet: https://atta.szlcsc.com/upload/public/pdf/source/20191216/C470675_E4DAD42BA33E5A1D426F2167779CD979.pdf; Supplier: LCSC; Convert to PCB: yes; Value: 20kΩ; Turns: -
RN1 RN3-RN41 = 4D03WGJ0101T5E: Manufacturer: UNI-ROYAL(厚声); Add into BOM: yes; Tolerance: ±5%; Power(Watts): 62.5mW; Number of Resistors: 4; Temperature Coefficient: ±200ppm/℃; Description: 阻值:100Ω;精度:±5%;单个元件功率:62.5mW;电阻器数:4;; Symbol: 4D03WGJ0101T5E; Device: 4D03WGJ0101T5E; LCSC Part Name: 100Ω ±5%; Supplier Part: C25506; Manufacturer Part: 4D03WGJ0101T5E; Supplier Footprint: 0603x4; JLCPCB Part Class: Extended Part; Datasheet: https://atta.szlcsc.com/upload/public/pdf/source/20170615/1497510993674.pdf; Supplier: LCSC; Convert to PCB: yes; Number of Pins: 8
  RN1 RN3-RN5 RN34: Name: 10K; Value: 10K
  RN6-RN26 RN35-RN41: Name: 100R; Value: 100R
  RN27-RN33: Name: 200R; Value: 200R
S1 = S端子母座: Add into BOM: yes; Name: S端子母座; Symbol: S端子母座; Device: S端子母座; Convert to PCB: yes; Origin Footprint: S端子母座
SW1 = DP-08BP: Manufacturer: 韩国韩荣; Add into BOM: yes; Current Rating: 25mA; Voltage Rating: 24V; Circuit: 单刀单掷; Number of Positions: 8; Operating Life: 3千次; Description: 类型:琴键;额定电流:25mA;额定电压:24V;电路结构:单刀单掷;开关位数:8;使用寿命:3千次;颜色:蓝色;; Name: DP-08BP; Symbol: DP-08BP; Device: DP-08BP; LCSC Part Name: 间距2.54mm 琴键 8位拨码开关; Supplier Part: C129056; Manufacturer Part: DP-08BP; Supplier Footprint: 插件; JLCPCB Part Class: Extended Part; Datasheet: https://atta.szlcsc.com/upload/public/pdf/source/20210810/79AA2E1F6EDC519505AF8DF4F29ADEEB.pdf; Supplier: LCSC; Convert to PCB: yes; Type: 琴键; Lead Pitch: 2.54mm; Operating Temperature: -20℃~+70℃; Color: 蓝色
TF1 = TF-012: Manufacturer: HANBO(汉博); Add into BOM: yes; Name: TF-012; Symbol: TF-012; Device: TF-012; link: https://item.szlcsc.com/400793.html; 3DModel: TF-SMD_TF-012; Supplier: LCSC; Supplier Part: C410350; Manufacturer Part: TF-012; JLCPCB Part Class: Extended Part; Convert to PCB: yes; Origin Footprint: TF-SMD_TF-012
U9 U10 = PM254-2-12-W-8.5: Manufacturer: HCTL(华灿天禄); Add into BOM: yes; Number of Holes: 24; Pitch: 2.54mm; Holes Structure: 2x12P; Circular Hole / Square Hole: 方孔; Current Rating (Max): 3A; Holes Direction: 侧面; Description: 排数:双排;总孔位数:24;间距:2.54mm;插孔结构:2x12P;行距:2.54mm;安装类型:弯插;圆孔/方孔:方孔;额定电流:3A;额定电压:-;插孔方向:侧面;塑高:8.5mm;工作温度范围:-40℃~+105℃;; Symbol: PM254-2-12-W-8.5; Device: PM254-2-12-W-8.5; Supplier: LCSC; Supplier Part: C2897432; JLCPCB Part Class: Extended Part; LCSC Part Name: 2.54mm 2x12P; Supplier Footprint: 弯插,P=2.54mm; Convert to PCB: yes; Number of Rows: 双排; Row Spacing: 2.54mm; Mounting Type: 弯插; Voltage Rating (Max): -; Insulation Height: 8.5mm; Operating Temperature Range: -40℃~+105℃
  U9: Name: PM254-2-12-W-8.5; Manufacturer Part: PM254-2-12-W-8.5
  U10: Name: 插槽排母; Manufacturer Part: 插槽排母
U11 = PM254-2-16-Z-8.5: Manufacturer: HCTL(华灿天禄); Add into BOM: yes; Number of Holes: 32P; Pitch: 2.54mm; Holes Structure: 2x16P; Circular Hole / Square Hole: 方孔; Current Rating (Max): 3A; Holes Direction: 顶部; Description: 排数:双排;总孔位数:32P;间距:2.54mm;插孔结构:2x16P;行距:2.54mm;安装类型:直插;圆孔/方孔:方孔;额定电流:3A;额定电压:-;插孔方向:顶部;塑高:8.5mm;工作温度范围:-40℃~+105℃;; Name: 核心排母右; Symbol: PM254-2-16-Z-8.5; Device: PM254-2-16-Z-8.5; Supplier: LCSC; Supplier Part: C2897417; Manufacturer Part: 核心排母右; JLCPCB Part Class: Extended Part; LCSC Part Name: 2.54mm 2x16P; Supplier Footprint: 插件,P=2.54mm; Datasheet: https://atta.szlcsc.com/upload/public/pdf/source/20230609/3D36CA2C1BFC9FD1C3F709AD9DFEB9C2.pdf; Convert to PCB: yes; Number of Rows: 双排; Row Spacing: 2.54mm; Mounting Type: 直插; Voltage Rating (Max): -; Insulation Height: 8.5mm; Operating Temperature Range: -40℃~+105℃
U12 = VGAS-C: Add into BOM: yes; Name: VGAS-C; Symbol: VGAS-C; Device: VGAS-C; LCSC Part Name: VGAS-C; Supplier Part: C9900021148; Manufacturer Part: VGAS-C; Supplier Footprint: VGA-15; JLCPCB Part Class: Extended Part; Datasheet: https://atta.szlcsc.comnull; Supplier: LCSC; Convert to PCB: yes
U13 = M51953BFP: Description: SMALL OUTLINE PACKAGE; Add into BOM: yes; Origin Footprint: SOP8; Name: M51953BFP; Symbol: M51953BFP; Device: M51953BFP; Convert to PCB: yes
U14 = PS-12E051: Manufacturer: G-Switch(品赞); Add into BOM: yes; Name: PS-12E051; Symbol: PS-12E051; Device: PS-12E051; Supplier: LCSC; Supplier Part: C2848939; Manufacturer Part: PS-12E051; link: https://atta.szlcsc.com/upload/public/pdf/source/20230616/1C9330BABF34D71FC1C7BAC39143366C.pdf; LCSC Part Name: 自锁直键开关; Supplier Footprint: 22.1x5.1x8.3mm; Datasheet: https://atta.szlcsc.com/upload/public/pdf/source/20230616/1C9330BABF34D71FC1C7BAC39143366C.pdf; Convert to PCB: yes
U15 = PTC1206SMD1206P010TF0.1A/60V: Add into BOM: yes; Name: PTC1206 0.75A/60V; Symbol: PTC1206SMD1206P010TF0.1A/60V; Device: PTC1206SMD1206P010TF0.1A/60V; LCSC Part Name: PTC1206SMD1206P010TF0.1A/60V; Supplier Part: C9900017664; Manufacturer Part: PTC1206 0.75A/60V; Supplier Footprint: 1206; JLCPCB Part Class: Extended Part; Datasheet: https://atta.szlcsc.comnull; Supplier: LCSC; Convert to PCB: yes
U18 = TPA6111A2DR: Manufacturer: TI(德州仪器); Add into BOM: yes; Description: 音频功率放大器的类型:-;输出类型:-;输出功率:-;工作电压:-;; Name: TPA6111A2DR; Symbol: TPA6111A2DR; Device: TPA6111A2DR; LCSC Part Name: TPA6111A2DR; Supplier Part: C497472; Manufacturer Part: TPA6111A2DR; Supplier Footprint: SOIC-8; JLCPCB Part Class: Extended Part; Datasheet: https://atta.szlcsc.com/upload/public/pdf/source/20200317/C497472_F7EF8F9EB7FECE0CE4AF91ADFC127601.pdf; Supplier: LCSC; Convert to PCB: yes; Type: -; Output Type: -; Max Output Power x Channels @ Load: -; Voltage - Supply: -; Features: -
USB1 = 907-111A1022D10200: Manufacturer: 精拓金; Symbol: Double layer DIP 90° black; Add into BOM: yes; Connector Type: Type-A; Gender: 母座; Number of Contacts: 8P; Number of Ports: 2; Description: 连接器类型:Type-A;标准:USB 2.0;公母:母座;触点数量:8P;端口数量:2;; Name: 907-111A1022D10200; Device: 907-111A1022D10200; Supplier: LCSC; Manufacturer Part: 907-111A1022D10200; Supplier Part: C12049; JLCPCB Part Class: Extended Part; LCSC Part Name: Type-A 母座; Supplier Footprint: 插件; Datasheet: https://atta.szlcsc.com/upload/public/pdf/source/20210226/C12049_574C92865F8D08A7C2B9F5B551F034C0.pdf; Convert to PCB: yes; Standard: USB 2.0
X1 = MINI_DIN_6: Add into BOM: yes; Name: MINI_DIN_6; Symbol: MINI_DIN_6; Device: MINI_DIN_6; Convert to PCB: yes; Origin Footprint: M_DIN6